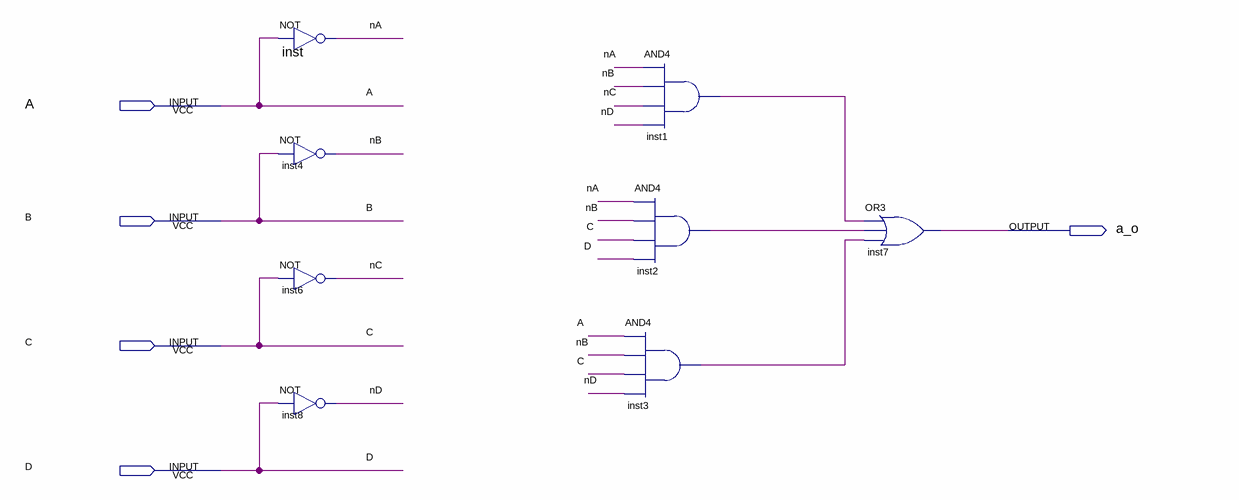
[diagram p0: schematic sheet]
// Quartus schematic a_out.bdf as structural Verilog: 8 symbols, 5 pins
module a_out (
  input  A,
  input  B,
  input  C,
  input  D,
  output a_o
);

  wire inst1_out, inst2_out, inst3_out, nA, nB, nC, nD;

  not inst (nA, A);
  not inst4 (nB, B);
  not inst6 (nC, C);
  not inst8 (nD, D);
  and inst1 (inst1_out, nA, nB, nC, nD);
  and inst2 (inst2_out, nA, nB, C, D);
  and inst3 (inst3_out, A, nB, C, nD);
  or inst7 (a_o, inst1_out, inst2_out, inst3_out);
endmodule
